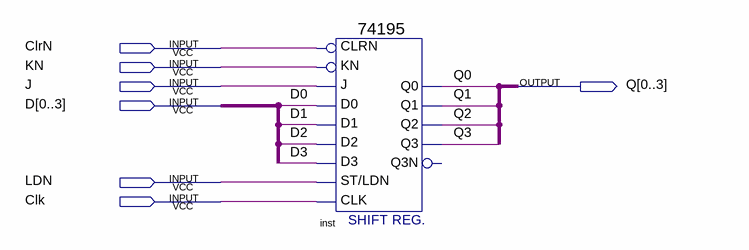
[diagram p0: schematic sheet]
// Quartus schematic pipo.bdf as structural Verilog: 1 symbols, 7 pins
module pipo (
  input  ClrN,
  input  KN,
  input  J,
  input  [0:3] D,
  input  LDN,
  input  Clk,
  output [0:3] Q
);

  \74195  inst (
    .\ST/LDN (LDN), .KN(KN), .CLRN(ClrN), .D2(D[2]), .D1(D[1]), .D0(D[0]), .J(J), .CLK(Clk), .D3(D[3]),
    .Q3(Q[3]), .Q0(Q[0]), .Q1(Q[1]), .Q2(Q[2]));  // open: Q3N
endmodule
